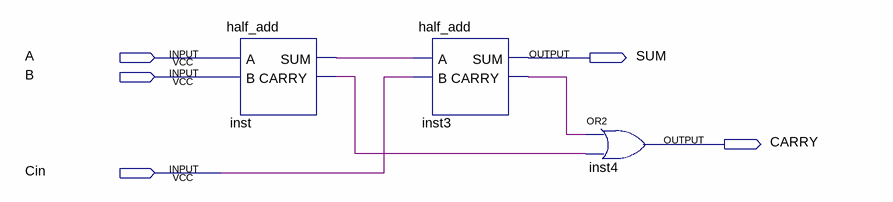
[diagram p0: schematic sheet]
// Quartus schematic full_add.bdf as structural Verilog: 3 symbols, 5 pins
module full_add (
  input  A,
  input  B,
  input  Cin,
  output SUM,
  output CARRY
);

  wire inst3_carry, inst_carry, inst_sum;

  half_add inst (.A(A), .B(B), .SUM(inst_sum), .CARRY(inst_carry));
  half_add inst3 (.A(inst_sum), .B(Cin), .SUM(SUM), .CARRY(inst3_carry));
  or inst4 (CARRY, inst3_carry, inst_carry);
endmodule
